# EAGLE design BatteryCharge (EAGLE 5.12)

## Sheet 1 of 2
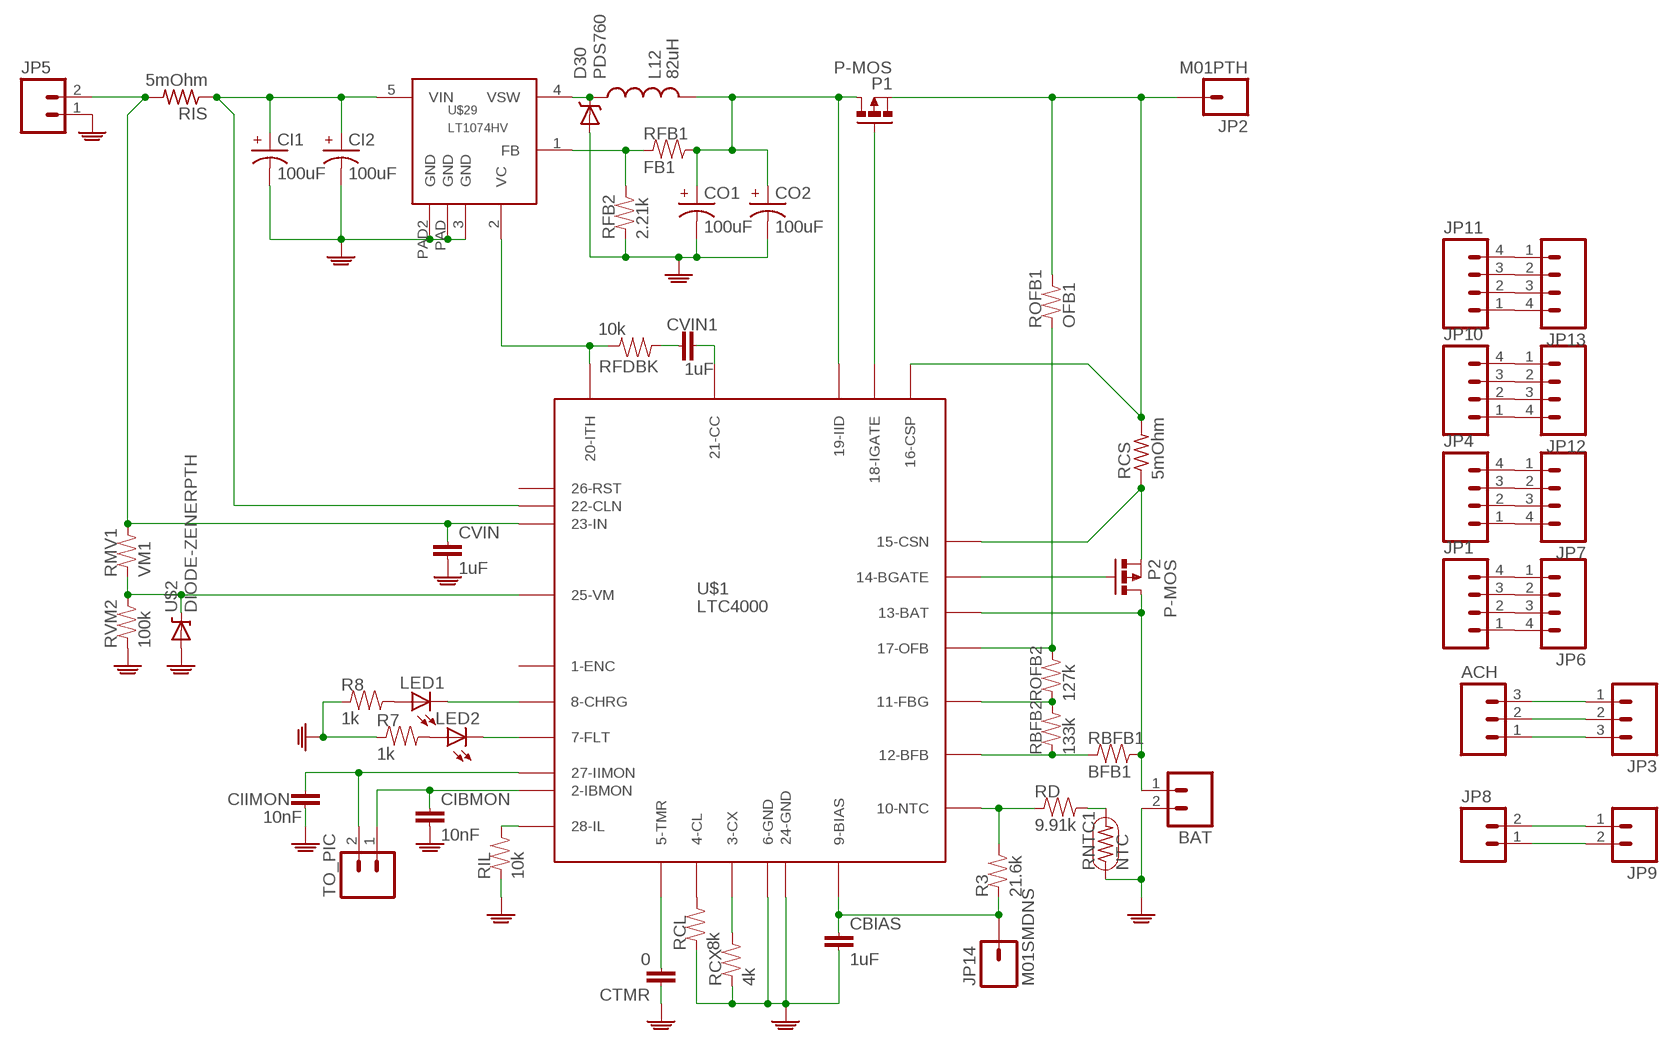
[diagram p0: schematic, sheet 1]

### Parts
ACH  M03ACH  [JST-3-ACH]
BAT  M02LOCK  [1X02_LOCK]
CBIAS  1uF  CAPPTH  [CAP-PTH-SMALL]
CI1  100uF  CAP-POLPCV10  [PCV10]
CI2  100uF  CAP-POLPCV10  [PCV10]
CIBMON  10nF  CAPPTH  [CAP-PTH-SMALL]
CIIMON  10nF  CAPPTH  [CAP-PTH-SMALL]
CO1  100uF  CAP-POLPCV10  [PCV10]
CO2  100uF  CAP-POLPCV10  [PCV10]
CTMR  0  CAPPTH  [CAP-PTH-SMALL]
CVIN  1uF  CAPPTH  [CAP-PTH-SMALL]
CVIN1  1uF  CAPPTH  [CAP-PTH-SMALL]
D30  PDS760  DIODE-SCHOTTKYPDS760  [POWERDI5]
JP1  M04PA-TH  [JST-4-PA-TH]
JP2  M01PTH  [1X01]
JP3  M03PTH  [1X03]
JP4  M04PA-SMD  [JST-4-PA-SMD]
JP5  M02MINI-FIT-JR  [WM8601]
JP6  M04PTH  [1X04]
JP7  M04PTH  [1X04]
JP8  M02JST-ACH  [JST-2-ACH]
JP9  M02PTH  [1X02]
JP10  M04PH-SMD  [JST-4-PH-SMD]
JP11  M04PH-TH  [JST-4-PH-TH]
JP12  M04PTH  [1X04]
JP13  M04PTH  [1X04]
JP14  M01SMDNS  [1X01NS]
L12  82uH  INDUCTOR2200LL-820  [2200LL-820]
LED1  LED0603  [0603-DIODE]
LED2  LED0603  [0603-DIODE]
P1  P-MOS  [D2PAK]
P2  P-MOS  [D2PAK]
R3  21.6k  R-SHORT1206  [1206]
R7  1k  R-SHORT0603  [0603]
R8  1k  R-SHORT0603  [0603]
RBFB1  BFB1  R-SHORT1206  [1206]
RBFB2  133k  R-SHORT1206  [1206]
RCL  8k  R-SHORT1206  [1206]
RCS  5mOhm  RPWR4412-B  [PWR4412-B]
RCX  4k  R-SHORT1206  [1206]
RD  9.91k  R-SHORT1206  [1206]
RFB1  FB1  R-SHORT1206  [1206]
RFB2  2.21k  R-SHORT1206  [1206]
RFDBK  10k  R-SHORT1206  [1206]
RIL  10k  R-SHORT1206  [1206]
RIS  5mOhm  RPWR4412-B  [PWR4412-B]
RMV1  VM1  R-SHORT1206  [1206]
RNTC1  NTC  R-NTCPTH  [CAP-PTH-SMALL]
ROFB1  OFB1  R-SHORT1206  [1206]
ROFB2  127k  R-SHORT1206  [1206]
RVM2  100k  R-SHORT1206  [1206]
TO_PIC  M02LOCK  [1X02_LOCK]
U$1  LTC4000  [SSOP28-NARROW]
U$2  DIODE-ZENERPTH  [DIODE-ZENER]
U$29  LT1074HV  [TO220-5]

### Nets
BAT: BAT.1 P2.D RBFB1.2 U$1.P$13(13-BAT)
BFB: RBFB1.1 RBFB2.1 U$1.P$12(12-BFB)
BGATE: P2.G U$1.P$14(14-BGATE)
BIAS: CBIAS.1 JP14.1 R3.1 U$1.P$9(9-BIAS)
BUCKOUT: CO1.+ CO2.+ L12.2 P1.D RFB1.2 U$1.P$19(19-IID)
CHRG: LED1.CAT(C) U$1.P$8(8-CHRG)
CSN: P2.S RCS.P$1 U$1.P$15(15-CSN)
CX: RCX.2 U$1.P$3(3-CX)
FBG: RBFB2.2 ROFB2.1 U$1.P$11(11-FBG)
FLT: LED2.CAT(C) U$1.P$7(7-FLT)
GND: BAT.2 CBIAS.2 CI1.- CI2.- CIBMON.2 CIIMON.2 CO1.- CO2.- CTMR.1 CVIN.2 D30.A JP5.1 R7.1 R8.1 RCL.1 RCX.1 RFB2.1 RIL.1 RNTC1.1 RVM2.1 U$1.P$6(6-GND) U$1.P$24(24-GND) U$2.P$2(A) U$29.3(GND) U$29.PAD2(GND) U$29.PAD(GND)
IBMON: CIBMON.1 TO_PIC.1 U$1.P$2(2-IBMON)
IGATE: P1.G U$1.P$18(18-IGATE)
IIMON: CIIMON.1 TO_PIC.2 U$1.P$27(27-IIMON)
IL: RIL.2 U$1.P$28(28-IL)
N$2: R3.2 RD.1 U$1.P$10(10-NTC)
N$3: CVIN.1 JP5.2 RIS.P$2 RMV1.2 U$1.P$23(23-IN)
N$4: ACH.3 JP3.1
N$5: ACH.2 JP3.2
N$6: RCL.2 U$1.P$4(4-CL)
N$7: ACH.1 JP3.3
N$8: JP1.4 JP6.1
N$9: JP1.3 JP6.2
N$10: RFDBK.2 U$1.P$20(20-ITH) U$29.2(VC)
N$11: JP1.2 JP6.3
N$12: JP1.1 JP6.4
N$13: JP4.4 JP7.1
N$14: JP4.3 JP7.2
N$15: JP8.2 JP9.1
N$16: JP8.1 JP9.2
N$17: LED2.AN(A) R7.2
N$18: LED1.AN(A) R8.2
N$19: JP4.2 JP7.3
N$20: JP4.1 JP7.4
N$21: JP10.4 JP12.1
N$22: JP10.3 JP12.2
N$23: JP10.2 JP12.3
N$24: JP10.1 JP12.4
N$25: CVIN1.2 U$1.P$21(21-CC)
N$26: CVIN1.1 RFDBK.1
N$27: CTMR.2 U$1.P$5(5-TMR)
N$28: JP11.4 JP13.1
N$29: JP11.3 JP13.2
N$30: JP11.2 JP13.3
N$31: JP11.1 JP13.4
N$142: D30.C L12.1 U$29.4(VSW)
N$143: RFB1.1 RFB2.2 U$29.1(FB)
OFB: ROFB1.1 ROFB2.2 U$1.P$17(17-OFB)
RD: RD.2 RNTC1.2
VIN: CI1.+ CI2.+ RIS.P$1 U$1.P$22(22-CLN) U$29.5(VIN)
VM: RMV1.1 RVM2.2 U$1.P$25(25-VM) U$2.P$1(C)
VOUT: JP2.1 P1.S RCS.P$2 ROFB1.2 U$1.P$16(16-CSP)
Unconnected: U$1.P$1(1-ENC) U$1.P$26(26-RST)

## Sheet 2 of 2
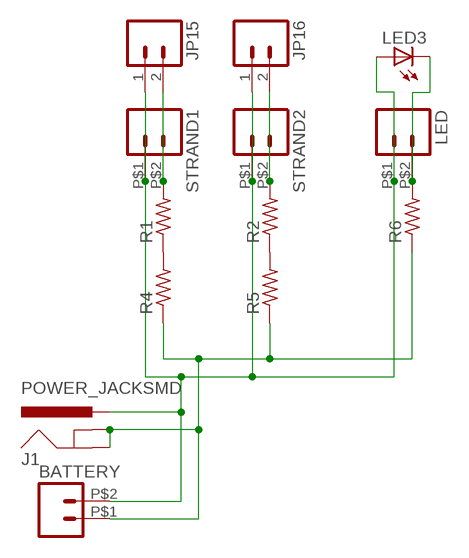
[diagram p1: schematic, sheet 2]

### Parts
BATTERY  M02JST-PA  [JST-2-PA]
J1  POWER_JACKSMD  [POWER_JACK_SMD]
JP15  M02PTH  [1X02]
JP16  M02PTH  [1X02]
LED  M02JST-PA-TH-TOP  [JST-2-PA-TH-TOP]
LED3  LED3MM  [LED3MM]
R1  R0207/10  [0207/10]
R2  R0207/10  [0207/10]
R4  R0207/10  [0207/10]
R5  R0207/10  [0207/10]
R6  R0207/10  [0207/10]
STRAND1  M02JST-PA-TH-TOP  [JST-2-PA-TH-TOP]
STRAND2  M02JST-PA-TH-TOP  [JST-2-PA-TH-TOP]

### Nets
+: BATTERY.P$2 J1.VIN0(PWR) JP15.1 JP16.1 LED3.A LED.P$1 STRAND1.P$1 STRAND2.P$1
-: BATTERY.P$1 J1.GND(GNDBREAK) J1.P$4(GND) R4.1 R5.1 R6.1
N$1: JP15.2 R1.2 STRAND1.P$2
N$32: JP16.2 R2.2 STRAND2.P$2
N$33: R1.1 R4.2
N$34: R2.1 R5.2
N$35: LED3.K(C) LED.P$2 R6.2

## Library data of the parts
ACH JP3 = Gibbot v4:M03: Header 3 Standard 3-pin 0.1" header. Use with straight break away headers (SKU : PRT-00116), right angle break away headers (PRT-00553), swiss pins (PRT-00743), machine pins (PRT-00117), and female headers (PRT-00115). Molex polarized connector foot print use with SKU : PRT-08232 with associated crimp pins and housings.
BAT BATTERY JP5 JP8 JP9 JP15 JP16 LED STRAND1 STRAND2 TO_PIC = Gibbot v4:M02: Header 2 Standard 2-pin 0.1" header. Use with straight break away headers (SKU : PRT-00116), right angle break away headers (PRT-00553), swiss pins (PRT-00743), machine pins (PRT-00117), and female headers (PRT-00115). Molex polarized connector foot print use with SKU : PRT-08233 with associated crimp pins and housings.
CBIAS CIBMON CIIMON CTMR CVIN CVIN1 = Gibbot v4:CAP: Capacitor Standard 0603 ceramic capacitor, and 0.1" leaded capacitor.
CI1 CI2 CO1 CO2 = Gibbot v4:CAP-POL: CAPACITOR, American symbol
D30 = Gibbot v4:DIODE-SCHOTTKY
J1 = Gibbot v4:POWER_JACK: Power Jack This is the standard 5.5mm barrel jack for power. The PTH is the most common, proven, reliable, footprint. All others are experimental. The Slot footprint only works if the mill layer is transmitted to the PCB fab house so be warned. Spark Fun Electronics SKU : PRT-00119. Mating wall wart : TOL-00298 (and others)
JP1 JP4 JP6 JP7 JP10-JP13 = Gibbot v4:M04: Header 4 Standard 4-pin 0.1" header. Use with straight break away headers (SKU : PRT-00116), right angle break away headers (PRT-00553), swiss pins (PRT-00743), machine pins (PRT-00117), and female headers (PRT-00115). Molex polarized connector foot print use with SKU : PRT-08231 with associated crimp pins and housings. 1MM SMD Version SKU: PRT-10208
JP2 JP14 = Gibbot v4:M01: Header 1 Standard 1-pin 0.1" header. Use with straight break away headers (SKU : PRT-00116), right angle break away headers (PRT-00553), swiss pins (PRT-00743), machine pins (PRT-00117), and female headers (PRT-00115).
L12 = Gibbot v4:INDUCTOR: Inductors Basic Inductor/Choke - 0603 and 1206. Footprints are not proven and vary greatly between part numbers.
LED1-LED3 = Gibbot v4:LED: LEDs Standard schematic elements and footprints for 5mm, 3mm, 1206, and 0603 sized LEDs. 5mm - Spark Fun Electronics SKU : COM-00529 (and others)
P1 P2 = Gibbot v4:P-MOS
R1 R2 R4-R6 RCS RIS = Gibbot v4:R: RESISTOR, American symbol
R3 R7 R8 RBFB1 RBFB2 RCL RCX RD RFB1 RFB2 RFDBK RIL RMV1 ROFB1 ROFB2 RVM2 = Gibbot v4:R-SHORT
RNTC1 = Gibbot v4:R-NTC
U$1 = Gibbot v4:LTC4000
U$2 = Gibbot v4:DIODE-ZENER: Zener Diode Production Part - 8199 3.4V Zener Voltage
U$29 = Gibbot v4:LT1074HV

## Board
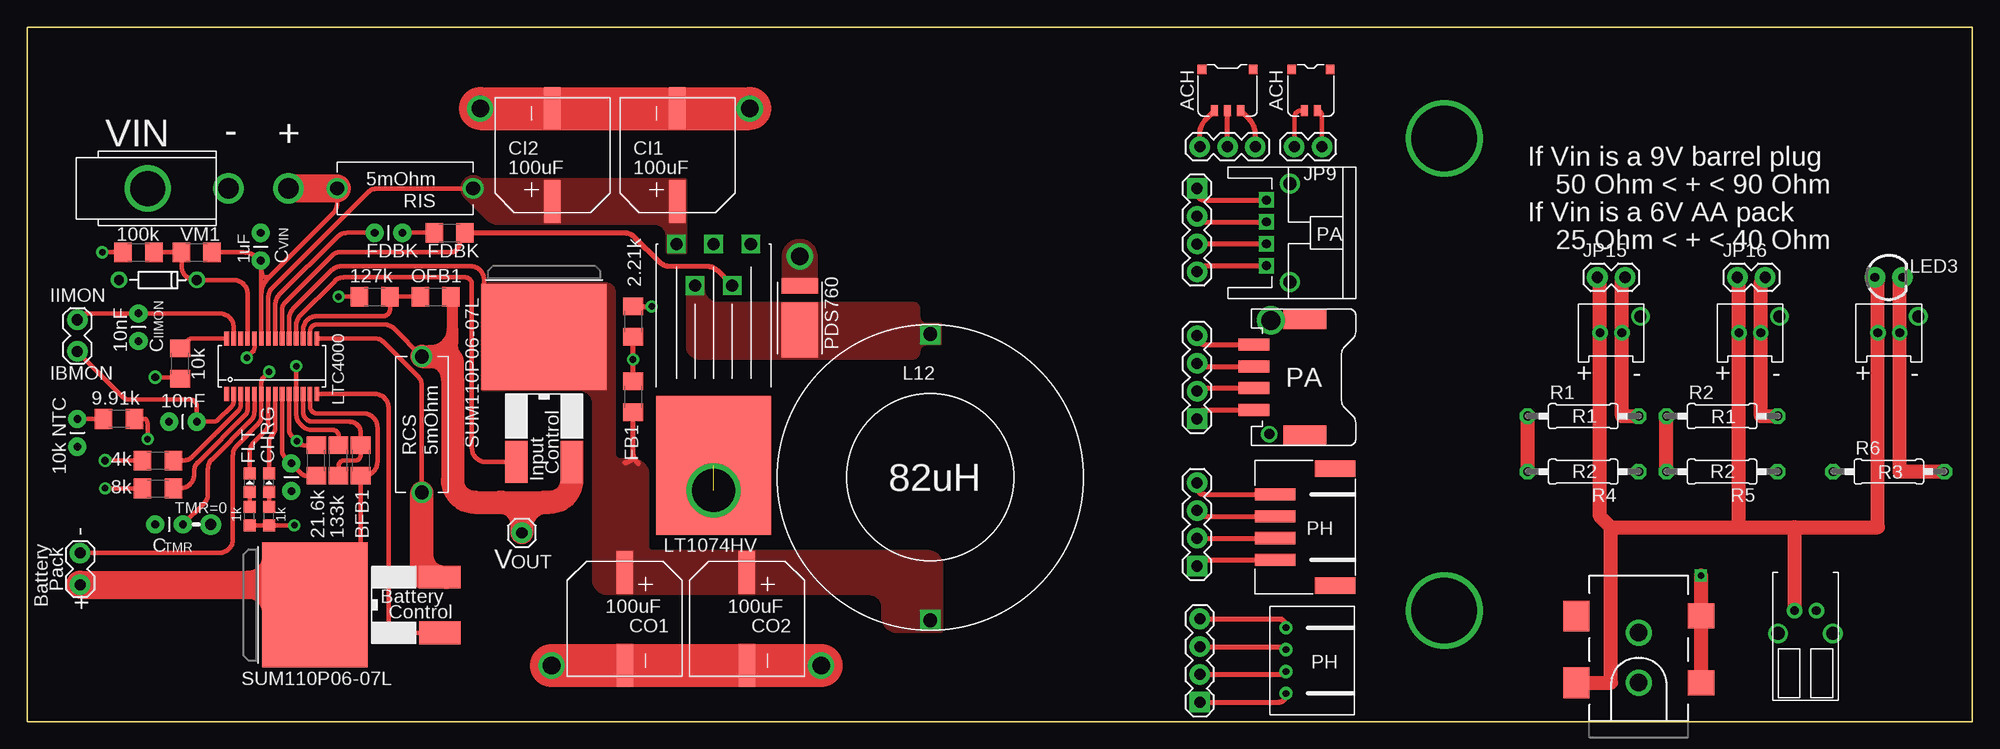
[diagram p2: board, top side]
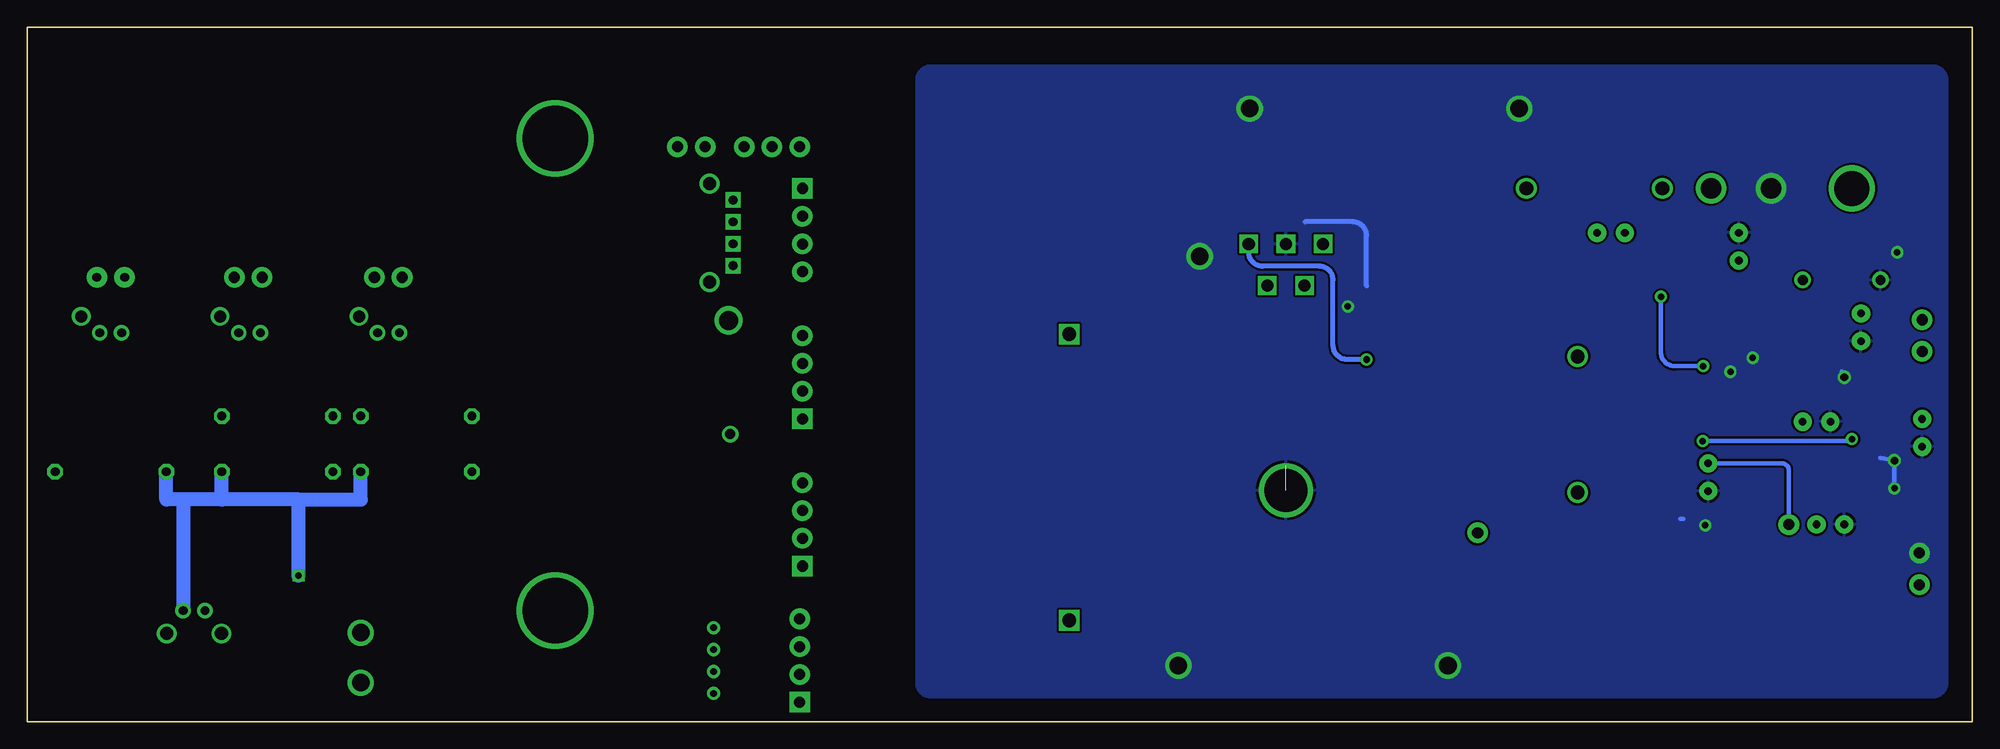
[diagram p3: board, bottom side, seen from below]

Size 177.8 x 63.5 mm. Coordinates in mm from the lower left corner, seen from the top.
Outline: 0,0 177.8,0 177.8,63.5 0,63.5 0,0
Copper layers (1*16): Top 0.035mm / dielectric 1.5mm / Bottom 0.035mm
Design rules "SparkFun *": minimum track width 8mil, minimum drill 20mil, track to track 8mil, track to pad 8mil, pad to pad 8mil, via to via 8mil, smd to smd 8mil, copper to edge 10mil, drill to drill 8mil, minimum pad ring 12mil, minimum via ring 10mil, stop-mask expansion 6mil, vias tented up to drill 25mil, thermal gap 10mil

### Footprints (pad centres in the part's own frame; a part is rotated, then mirrored left to right if it is on the bottom)
JST-3-ACH = smd 0.65 x 1: 1 -1.2,0; 2 0,0; 3 1.2,0 | smd 0.8 x 0.85: P$4 2.35,3.775; P$5 -2.35,3.775
1X02_LOCK = drill 1.016 pad 1.88 round: 1 -0.178,0; 2 2.718,0
JST-2-PA = drill 0.8 round: P$1 -1,0; P$2 1,0 | drill 1.2 pad 1.397 round: P$3 -2.5,2.1; P$4 2.5,2.1
CAP-PTH-SMALL = drill 0.7 pad 1.651 round: 1 0,0; 2 2.54,0
PCV10 = smd 1.5 x 3.9: + 0,-4.25; - 0,4.25
POWERDI5 = smd 3.36 x 1.4: A 0,-4.057 | smd 3.36 x 5.01: C 0,0
POWER_JACK_SMD = smd 2.286 x 2.4: GND 0,-5.7; P$4 6.1,-5.7 | drill 1.6 pad 1.778 round: P$1 4.572,0; P$2 0,0 | smd 2.8 x 2.4: VIN0 0,5.7; VIN1 6.1,5.7
JST-4-PA-TH = drill 0.8 square: 1 3,0; 2 1,0; 3 -1,0; 4 -3,0 | drill 1.2 pad 1.397 round: P$1 4.5,2.15; P$2 -4.5,2.15
1X01 = drill 1.016 pad 1.88 round: 1 0,0
1X03 = drill 1.016 pad 1.88 round: 1 0,0; 2 2.54,0; 3 5.08,0
JST-4-PA-SMD = smd 1.1 x 2.8: 1 -3,1.4; 2 -1,1.4; 3 1,1.4; 4 3,1.4 | drill 1.727 pad 1.956 round: P$1 -5.2,2.95 | drill 0.9 pad 1.092 round: P$2 5.2,2.8 | smd 1.9 x 3.9: P$5 -5.35,6.05; P$6 5.35,6.05
WM8601 = drill 1.854 round: 1 0,1.1; 2 0,6.6 | drill 3.2 round: P$1 0,-6.274
1X04 = drill 1.016 pad 1.88 square: 1 0,0 | drill 1.016 pad 1.88 round: 2 2.54,0; 3 5.08,0; 4 7.62,0
JST-2-ACH = smd 0.65 x 1: 1 -0.6,0; 2 0.6,0 | smd 0.8 x 0.85: P$4 1.75,3.775; P$5 -1.75,3.775
1X02 = drill 1.016 pad 1.88 round: 1 0,0; 2 2.54,0
JST-4-PH-SMD = smd 1.1 x 3.7: 1 -3,-7.35; 2 -1,-7.35; 3 1,-7.35; 4 3,-7.35 | smd 1.5 x 3.7: P$1 -5.35,-1.85; P$2 5.35,-1.85
JST-4-PH-TH = drill 0.6 round: 1 -3,0; 2 -1,0; 3 1,0; 4 3,0
1X01NS = drill 1.016 pad 1.88 round: 1 0,0
2200LL-820 = drill 1.27 square: 1 0,13.081; 2 0,-13.081
JST-2-PA-TH-TOP = drill 0.8 round: P$1 -1,0; P$2 1,0 | drill 1.1 pad 1.295 round: P$3 2.7,1.5
0603-DIODE = smd 1.1 x 1.1: AN -0.85,0; CAT 0.85,0
LED3MM = drill 0.813 pad 1.88 round: A -1.27,0; K 1.27,0
D2PAK = smd 11.43 x 9.65: D 0,4.445 | smd 2.083 x 3.81: G -2.54,-6.985; S 2.54,-6.985
0207/10 = drill 0.813 octagon: 1 -5.08,0; 2 5.08,0
1206 = smd 1.6 x 1.8: 1 -1.4,0; 2 1.4,0
0603 = smd 1.1 x 1.1: 1 -0.85,0; 2 0.85,0
PWR4412-B = drill 1.27 round: P$1 -6.225,0; P$2 6.225,0
SSOP28-NARROW = smd 0.432 x 1.27: P$1 -4.128,-2.54; P$2 -3.493,-2.54; P$3 -2.857,-2.54; P$4 -2.223,-2.54; P$5 -1.587,-2.54; P$6 -0.953,-2.54; P$7 -0.318,-2.54; P$8 0.318,-2.54; P$9 0.953,-2.54; P$10 1.587,-2.54; P$11 2.223,-2.54; P$12 2.857,-2.54; P$13 3.493,-2.54; P$14 4.128,-2.54; P$15 4.128,2.54; P$16 3.493,2.54; P$17 2.857,2.54; P$18 2.223,2.54; P$19 1.587,2.54; P$20 0.953,2.54; P$21 0.318,2.54; P$22 -0.318,2.54; P$23 -0.953,2.54; P$24 -1.587,2.54; P$25 -2.223,2.54; P$26 -2.857,2.54; P$27 -3.493,2.54; P$28 -4.128,2.54
DIODE-ZENER = drill 0.9 round: P$1 -3.556,0; P$2 3.556,0
TO220-5 = drill 1.1 square: 1 3.81,-3.404; 2 0,-1.702; 3 3.81,0; 4 0,1.702; 5 3.81,3.404 | smd 12.7 x 10.541: PAD -16.434,0 | drill 3.937 round: PAD2 -18.72,0

### Placement (x,y rotation side)
ACH  109.73,55.88 0 top
BAT  4.83,12.7 90 top
BATTERY  162.56,10.16 180 top
CBIAS  24.13,23.62 270 top
CI1  59.44,51.82 0 top
CI2  48.01,51.82 0 top
CIBMON  15.49,27.43 180 top
CIIMON  10.16,37.34 270 top
CO1  54.61,9.4 180 top
CO2  65.79,9.4 180 top
CTMR  11.68,18.03 0 top
CVIN  21.34,42.16 90 top
CVIN1  34.29,44.7 180 top
D30  70.61,35.81 180 top
J1  147.32,3.56 90 top
JP1  113.28,44.7 270 top
JP2  45.21,17.27 0 top
JP3  112.27,52.58 180 top
JP4  110.74,31.5 270 top
JP5  17.27,48.77 270 top
JP6  106.93,48.77 270 top
JP7  106.93,27.69 90 top
JP8  117.35,55.88 0 top
JP9  118.36,52.58 180 top
JP10  121.41,17.78 270 top
JP11  115.06,5.59 270 top
JP12  106.93,14.22 90 top
JP13  107.19,1.78 90 top
JP14  16.76,18.03 0 top
JP15  143.54,40.64 0 top
JP16  156.34,40.64 0 top
L12  82.55,22.35 0 top
LED  170.18,35.56 0 top
LED1  22.1,21.84 90 top
LED2  20.32,21.84 90 top
LED3  170.18,40.64 0 top
P1  47.24,30.73 0 top
P2  30.73,10.67 90 top
R1  142.24,27.94 0 top
R2  154.94,27.94 0 top
R3  26.42,23.88 90 top
R4  142.24,22.86 180 top
R5  154.94,22.86 180 top
R6  170.18,22.86 0 top
R7  20.32,18.8 90 top
R8  22.1,18.8 90 top
RBFB1  30.48,23.88 270 top
RBFB2  28.45,23.88 90 top
RCL  11.94,21.34 0 top
RCS  36.07,27.18 90 top
RCX  11.94,23.88 0 top
RD  8.38,27.69 180 top
RFB1  55.37,29.72 270 top
RFB2  55.37,36.58 270 top
RFDBK  38.61,44.7 0 top
RIL  13.97,32.77 90 top
RIS  34.54,48.77 180 top
RMV1  15.49,42.93 0 top
RNTC1  4.57,25.15 90 top
ROFB1  37.34,38.86 0 top
ROFB2  31.75,38.86 0 top
RVM2  10.16,42.93 0 top
STRAND1  144.78,35.56 0 top
STRAND2  157.48,35.56 0 top
TO_PIC  4.57,34.04 90 top
U$1  22.35,32.51 0 top
U$2  11.94,40.39 180 top
U$29  62.74,39.88 90 top

### Tracks (layer width: path | path; a pad name or v marks a point on that pad's centre or on a via)
+
  Top 1.27: 156.48,17.78 STRAND2.P$1 156.48,40.5 JP16.1 | 144.78,17.78 156.48,17.78 | 161.56,17.78 BATTERY.P$2 | 156.48,17.78 161.56,17.78 | 161.56,17.78 169.18,17.78 LED.P$1 169.18,40.37 LED3.A | JP15.1 143.78,40.4 STRAND1.P$1 143.78,18.78 144.78,17.78 | J1.VIN0 144.78,3.56 144.78,17.78
-  (via drill 0.6)
  Top 1.27: J1.GND J1.P$4 v153.02,13.36 v153.01,13.36
  Bottom 1.27: v153.01,13.36 153.01,20.32 | 153.01,20.32 147.32,20.32 R4.1 | 153.01,20.32 160.02,20.32 | 160.02,20.32 R5.1 | R6.1 165.1,20.32 163.56,20.32 | 163.56,20.32 BATTERY.P$1 | 160.02,20.32 163.56,20.32
BAT
  Top 0.406: 27.94,11.76 arc90 30.48,13.79 RBFB1.2 30.73,22.48 arc90 32,23.75 32,26.92 arc90 30.73,28.19 26.48,28.19 arc-90 25.84,28.83 U$1.P$13
  Top 0.457: 24.38,12.52 27.94,11.76
  Top 2.54: 20.19,12.52 arc-90 22.73,9.98 22.73,9.78 | BAT.1 20.19,12.52 | 20.19,12.52 arc90 22.73,15.06 22.73,14.94 24.94,14.94 arc-90 25.91,13.97 | 20.19,12.52 24.38,12.52 25.7,11.76 arc-90 P2.D
BFB
  Top 0.406: RBFB2.1 28.45,23.37 arc-90 28.96,23.88 29.97,23.88 arc90 30.48,24.38 RBFB1.1 30.48,26.42 arc90 29.46,27.43 26.1,27.43 arc-90 25.21,28.32 U$1.P$12
BGATE
  Top 0.406: U$1.P$14 31.75,29.97 arc-90 33.02,28.7 33.02,9.4 arc90 34.29,8.13 P2.G
BIAS
  Top 0.406: U$1.P$9 23.3,24.71 arc45 23.49,24.26 CBIAS.1 25.09,22.66 arc45 25.54,22.48 R3.1
  Bottom 0.406: JP14.1 16.76,22.99 arc-90 17.4,23.62 CBIAS.1
BUCKOUT
  Top 0.406: U$1.P$19 23.94,36.88 arc-45 24.31,37.77 27.82,41.28 arc-45 28.72,41.66 40.49,41.66 arc-90 41.76,40.39 41.76,38.94
  Top 0.457: 54.63,23.7 arc90 55.37,24.43 | RFB1.2 55.37,24.63 arc45 55.74,23.73 55.88,23.6
  pour Top (no thermals): 41.61,39.95 41.61,30.43 50.55,30.43 arc-90 51.82,29.16 51.82,13.03 arc90 53.09,11.76 77.01,11.76 arc-90 78.28,10.49 78.28,9.58 arc90 79.55,8.31 83.52,8.31 83.52,14.25 arc90 82.25,15.52 57.12,15.52 arc-90 56.64,16 56.64,22.61 arc90 55.37,23.88 54.23,23.88 arc-90 53.59,24.51 53.59,39.27 arc90 52.91,39.95
CHRG
  Top 0.406: LED1.CAT 22.1,25.55 arc-45 22.35,26.16 arc45 22.67,26.93 U$1.P$8
CSN
  Top 0.406: U$1.P$15 31.73,35.05 arc-45 32.63,34.68 35.7,31.61 arc-45 36.07,30.72 RCS.P$1
  Top 0.457: RCS.P$1
  Top 1.016: P2.S 37.72,12.68 35.89,12.68
  Top 2.083: RCS.P$1 36.07,13.21 P2.S | RCS.P$1 36.07,15.24 arc90 38.1,13.21 38.51,13.21
CX
  Top 0.406: U$1.P$3 19.49,28.9 arc-45 19.31,28.45 15.1,24.25 arc-45 14.21,23.88 RCX.2
FBG  (via drill 0.6)
  Top 0.406: v28.45,38.86 ROFB2.1 | v24.59,32.51 arc45 24.57,32.36 U$1.P$11 24.57,28.19 arc90 26.1,26.67 27.94,26.67 arc-90 28.45,26.16 RBFB2.2
  Bottom 0.406: v28.45,38.86 28.45,33.78 arc-90 27.18,32.51 v24.59,32.51
FLT
  Top 0.406: LED2.CAT 20.32,24.62 arc-45 20.69,25.52 21.66,26.49 arc45 22.04,27.39 U$1.P$7
GND  (via drill 0.6, 0.7, 1.6)  (1 unrouted)
  Top 0.127: 65.96,5.14 CO2.- | CO1.-
  Top 0.406: BAT.2 17.53,15.42 arc90 18.8,16.69 18.8,24.37 arc-45 19.17,25.26 21.03,27.12 arc45 21.4,28.02 U$1.P$6 21.4,31.04 arc-45 21.59,31.49 v22.1,32 | 22.15,17.9 R8.1 R7.1 24.38,17.95 arc45 v24.41,17.96 | RIL.1 arc45 13.66,31.5 v11.68,31.5 | v7.11,23.88 RCX.1 | U$1.P$24 20.77,34.24 arc-45 20.58,33.79 v20.07,33.27 | v6.86,42.93 RVM2.1 | v7.11,21.34 RCL.1
  Top 0.457: RFB2.1 v57.07,37.98 arc-90 v57.07,37.97
  Top 3.912: v41.4,56.07 CI2.- CI1.- v66.04,56.07 | v72.57,5.14 65.96,5.14 CO1.- v47.93,5.14
  Bottom 0.406: 26.67,18.54 26.42,18.54 | v11.68,31.5 11.76,31.57 arc45 11.94,32 | 8.38,24.13 v7.11,23.88 v7.11,21.34 | v22.1,32 22.1,32.26 | v20.07,33.27 19.81,33.53 | v6.86,42.93 6.86,43.18 | v24.41,17.96 24.41,18.23 arc45 24.38,18.29
  Bottom 0.457: 55.37,39.88 55.37,44.45 arc-90 56.64,45.72 60.96,45.72 | v57.07,37.97 arc90 57.15,38.05 57.15,38.2
  other vias: 70.61,42.55
  pour Bottom: 3.56,59.94 95.25,59.94 arc-90 96.52,58.67 96.52,3.56 arc-90 95.25,2.29 3.56,2.29 arc-90 2.29,3.56 2.29,58.67 arc-90
  pour Top (no thermals): 69.09,39.29 69.09,42.57 arc-90 70.61,44.09 arc-90 72.14,42.57 72.14,39.27 69.11,39.27
  pour Bottom (no thermals): 16.26,50.8 20.57,50.8 20.57,46.74 16.26,46.74
  pour Bottom (no thermals): 3.3,17.02 6.6,17.02 6.6,13.97 3.3,13.97
IBMON
  Top 0.406: U$1.P$2 18.86,29.28 arc-45 18.67,28.83 17.46,27.62 arc-45 17.01,27.43 CIBMON.1 15.49,28.83 arc90 14.86,29.46 9.23,29.46 arc-45 8.78,29.65 TO_PIC.1
IGATE
  Top 0.406: U$1.P$18 24.57,36.24 arc-45 24.95,37.14 28.08,40.27 arc-45 28.97,40.64 40.01,40.64 arc-90 40.64,40.01 40.64,25.02 arc90 41.91,23.75 P1.G
IIMON
  Top 0.406: U$1.P$27 18.86,36.07 arc90 17.59,37.34 CIIMON.1 5.42,37.34 arc45 4.97,37.15 TO_PIC.2
IL
  Top 0.406: RIL.2 14.67,34.87 arc-45 15.12,35.05 U$1.P$28
N$1
  Top 1.27: R1.2 145.78,27.94 STRAND1.P$2 145.78,40.34 JP15.2
N$2  (via drill 0.6)
  Top 0.406: U$1.P$10 23.94,26.62 arc45 24.12,26.17 v24.64,25.65 24.83,25.46 arc45 25.28,25.28 R3.2 | v10.99,25.84 10.99,27.23 arc45 10.8,27.68 RD.1
  Bottom 0.406: v24.64,25.65 11.44,25.65 arc-45 v10.99,25.84 10.92,25.91
N$3
  Top 0.406: 21.39,41.99 21.41,41.53 arc30 21.49,40.82 21.55,40.75 arc45 21.89,40.64 arc45 22.32,40.87 | RIS.P$2 28.32,47.39 arc-45 27.95,46.49 22.32,40.87 | U$1.P$23 21.4,39.12 | 21.4,39.12 arc-45 22,40.54 22.32,40.87 | RMV1.2 19.73,42.93 arc-45 21.17,42.33 CVIN.1 arc-45 21.4,42.04 21.4,39.12
  Top 2.54: RIS.P$2 JP5.2
N$4
  Top 0.457: ACH.3 111.67,55.13 arc-45 112.27,53.7 JP3.1
N$5
  Top 0.457: JP3.2 ACH.2
N$6
  Top 0.406: U$1.P$4 20.13,28.52 arc-45 19.94,28.07 15.6,23.73 arc45 15.24,22.86 15.24,22.61 arc-90 13.97,21.34 RCL.2
N$7
  Top 0.457: ACH.1 107.78,55.13 arc45 107.19,53.7 JP3.3
N$8
  Top 0.457: JP1.4 107.57,47.7 arc-90 106.93,48.34 JP6.1
N$9
  Top 0.457: JP1.3 107.46,45.7 arc-90 JP6.2
N$10
  Top 0.406: U$1.P$20 23.3,37.77 arc-45 23.49,38.22 28.01,42.74 arc-45 28.46,42.93 38.87,42.93 arc90 39.51,44.07 RFDBK.2
  Top 0.457: RFDBK.2 54.59,44.7 arc-45 55.49,44.33 57.79,42.03 arc45 58.69,41.66 62.14,41.66 arc-45 63.03,41.28 U$29.2
N$11
  Top 0.457: JP1.2 106.95,43.7 arc90 JP6.3
N$12
  Top 0.457: JP1.1 107.49,41.7 arc90 JP6.4
N$13
  Top 0.457: JP4.4 107.57,28.5 arc90 106.93,27.86 JP7.1
N$14
  Top 0.457: JP4.3 107.2,30.5 arc90 JP7.2
N$15
  Top 0.406: JP9.1 118.36,55.46 arc90 JP8.2
N$16
  Top 0.406: JP8.1 116.46,55.88 arc90 115.82,55.24 JP9.2
N$17
  Top 0.406: R7.2 LED2.AN
N$18
  Top 0.406: R8.2 LED1.AN
N$19
  Top 0.457: JP4.2 107.2,32.5 arc-90 JP7.3
N$20
  Top 0.457: JP4.1 107.57,34.5 arc-90 106.93,35.13 JP7.4
N$21
  Top 0.457: JP10.4 107.49,14.78 arc90 JP12.1
N$22
  Top 0.457: JP10.3 106.95,16.78 arc90 JP12.2
N$23
  Top 0.457: JP10.2 107.46,18.78 arc-90 JP12.3
N$24
  Top 0.457: JP10.1 107.57,20.78 arc-90 106.93,21.41 JP12.4
N$25
  Top 0.406: U$1.P$21 22.67,38.15 arc-45 23.04,39.04 28.33,44.33 arc-45 29.23,44.7 CVIN1.2
N$26
  Top 0.406: CVIN1.1 RFDBK.1
N$27
  Top 0.406: U$1.P$5 20.77,28.4 arc-45 20.39,27.5 16.88,23.99 arc45 16.51,23.1 16.51,20.83 arc-45 16.15,19.96 CTMR.2
N$28
  Top 0.457: JP13.1 114.43,1.78 arc90 115.06,2.41 JP11.4
N$29
  Top 0.457: JP13.2 114.79,4.32 arc90 JP11.3
N$30
  Top 0.457: JP13.3 114.79,6.86 arc-90 JP11.2
N$31
  Top 0.457: JP13.4 114.43,9.4 arc-90 115.06,8.76 JP11.1
N$32
  Top 1.27: R2.2 158.48,27.94 STRAND2.P$2 158.48,40.24 JP16.2
N$33
  Top 1.27: R4.2 R1.1
N$34
  Top 1.27: R5.2 R2.1
N$35
  Top 1.27: R6.2 171.18,22.86 LED.P$2 171.18,40.37 LED3.K
N$36  (via drill 6)
  other vias: 129.54,53.34
N$37  (via drill 6)
  other vias: 129.54,10.16
N$142
  pour Top (no thermals): 60.25,40.69 61.87,40.69 61.87,39.6 arc90 63.14,38.33 80.95,38.33 arc-90 81.58,37.69 81.58,37.03 arc90 82.22,36.4 83.52,36.4 83.52,34.47 82.17,34.47 arc90 81.58,33.88 arc-90 80.87,33.15 61.52,33.15 arc-90 60.25,34.42
N$143  (via drill 0.6)
  Top 0.457: RFB1.1 v55.37,33.12 RFB2.2
  Bottom 0.457: U$29.1 66.14,42.93 arc-90 64.87,41.66 59.69,41.66 arc90 58.42,40.39 58.42,34.39 arc-90 57.15,33.12 v55.37,33.12
OFB
  Top 0.406: ROFB1.1 ROFB2.2 33.15,37.72 arc-90 32.52,37.08 26.48,37.08 arc90 25.21,35.81 U$1.P$17
RD
  Top 0.406: RNTC1.2 RD.2
VIN
  Top 0.406: U$1.P$22 22.04,38.78 arc-45 22.41,39.68 31.12,48.4 arc-45 32.02,48.77 RIS.P$1
  pour Top (no thermals): 60.12,49.5 60.12,42.93 58.57,42.93 58.57,44.4 arc90 57.33,45.64 43.05,45.64 arc-45 42.15,46.02 40.08,48.08 arc-90 40.06,49.43 arc-90 41.35,49.56 41.58,49.5
VM
  Top 0.406: RVM2.2 RMV1.1 14.09,41.66 arc90 15.36,40.39 U$2.P$1 18.86,40.39 arc-90 20.13,39.12 U$1.P$25
VOUT
  Top 0.025: 45.21,18.03 arc-90 44.96,17.78 44.68,17.78 | 36.83,33.4 36.83,33.93
  Top 0.406: U$1.P$16 25.84,35.69 arc-90 26.48,36.32 32.62,36.32 arc-45 33.52,35.95 RCS.P$2
  Top 1.016: 38.86,38.86 ROFB1.2 arc-45 38.86,38.56 38.86,35.97 | 44.68,18.06 44.68,17.78 44.68,17.6 | 38.86,35.97 38.86,34.59 arc45 39.12,33.6 arc-45 39.4,32.79 39.4,31.22 | 38.86,35.97 arc-90 36.83,33.93 36.75,33.93
  Top 2.083: 47.5,20.07 arc90 45.21,17.78 JP2.1 45.21,18.03 arc90 43.18,20.07 | RCS.P$2 36.83,33.4 arc-90 38.86,31.37 38.86,22.1 arc90 40.89,20.07 43.18,20.07 | 43.18,20.07 47.5,20.07 | 47.5,20.07 47.75,20.07 arc90 49.78,22.1 P1.S

### Text on the board
tPlace: ACH | ACH | VIN | - | + | If Vin is a 9V barrel plug | 100uF | 100uF | 50 Ohm < + < 90 Ohm | If Vin is a 6V AA pack | 100k | VM1 | 2.21k | PA | VIN | 25 Ohm < + < 40 Ohm | 1uF | C | FDBK | FDBK | 127k | OFB1 | IIMON | IIMON | 10nF | C | PDS760 | IBMON | 10k | PA | + | - | + | - | + | - | 9.91k | 10nF | LTC4000 | FB1 | R1 | R1 | SUM110P06-07L | FLT | CHRG | 10k NTC | 4k | Control | Input | R2 | R2 | R3 | 8k | TMR=0 | 1k | 1k | - | 21.6k | 133k | BFB1 | PH | C | TMR | LT1074HV | V | OUT | Pack | Battery | Battery | + | 100uF | 100uF | Control | PH | SUM110P06-07L